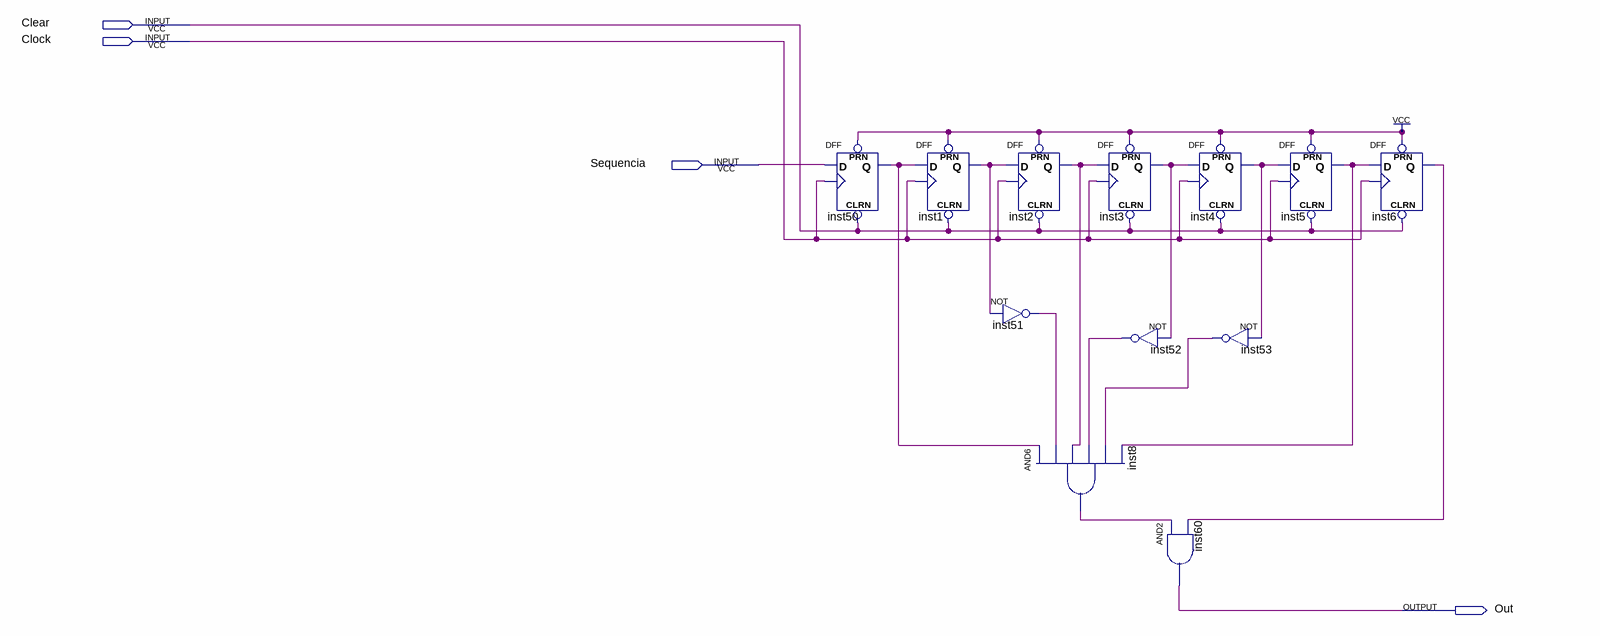
[diagram p0: schematic sheet]
// Quartus schematic Detector_direto.bdf as structural Verilog: 12 symbols, 4 pins
module Detector_direto (
  input  Clear,
  input  Clock,
  input  Sequencia,
  output Out
);

  wire inst1_q, inst2_q, inst3_q, inst4_q, inst5_q, inst6_q, inst8_out, inst50_q, inst51_out, inst52_out,
       inst53_out;

  DFF inst50 (.CLRN(Clear), .CLK(Clock), .D(Sequencia), .PRN(1'b1), .Q(inst50_q));
  DFF inst1 (.CLRN(Clear), .CLK(Clock), .D(inst50_q), .PRN(1'b1), .Q(inst1_q));
  DFF inst2 (.CLRN(Clear), .CLK(Clock), .D(inst1_q), .PRN(1'b1), .Q(inst2_q));
  not inst51 (inst51_out, inst1_q);
  and inst8 (inst8_out, inst50_q, inst51_out, inst2_q, inst52_out, inst53_out, inst5_q);
  DFF inst3 (.CLRN(Clear), .CLK(Clock), .D(inst2_q), .PRN(1'b1), .Q(inst3_q));
  not inst52 (inst52_out, inst3_q);
  DFF inst4 (.CLRN(Clear), .CLK(Clock), .D(inst3_q), .PRN(1'b1), .Q(inst4_q));
  and inst60 (Out, inst8_out, inst6_q);
  not inst53 (inst53_out, inst4_q);
  DFF inst5 (.CLRN(Clear), .CLK(Clock), .D(inst4_q), .PRN(1'b1), .Q(inst5_q));
  DFF inst6 (.CLRN(Clear), .CLK(Clock), .D(inst5_q), .PRN(1'b1), .Q(inst6_q));
endmodule
